# EasyEDA Pro project ProPrj_IoT House_2026-04-28.epro, board PCB1
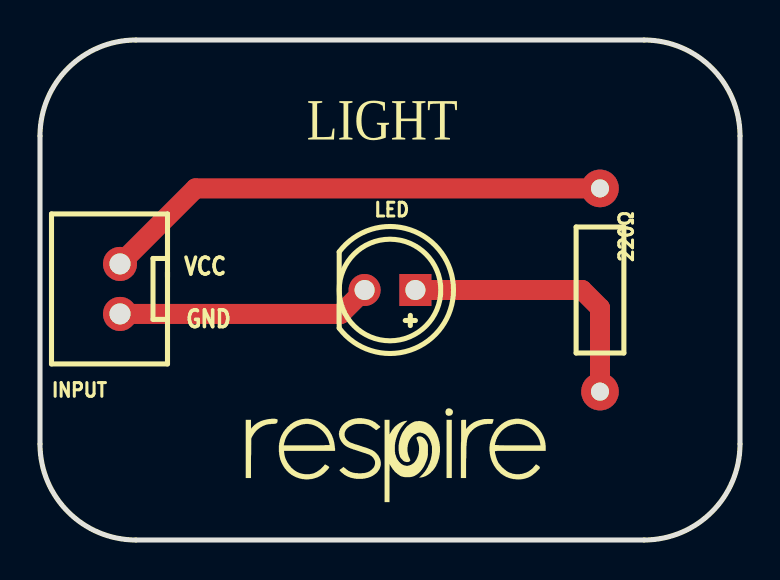
[diagram p5: board, top side]
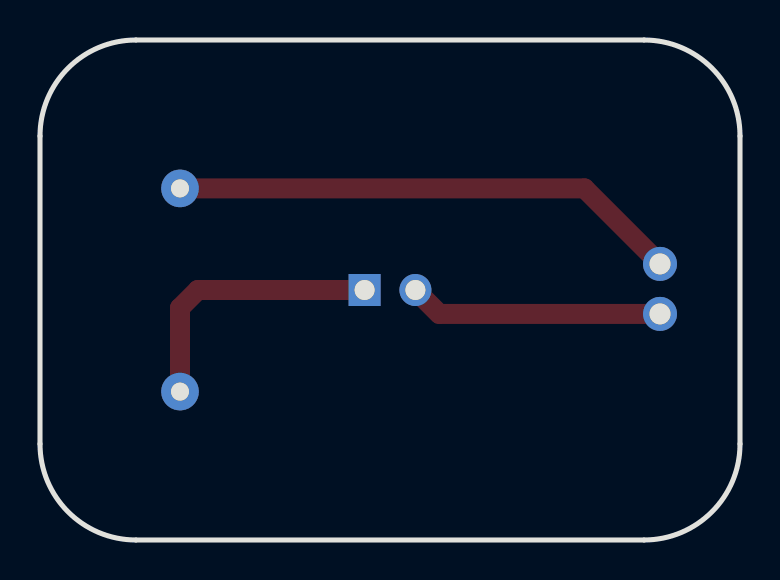
[diagram p6: board, bottom side, seen from below]

Outline 35 x 25 mm; copper layers: Top Layer, Bottom Layer. Coordinates in mm from the lower left corner of the outline.
Outline path: 0,20.2 0,4.8 arc(1.41,1.41) 4.8,0 30.2,0 arc(33.59,1.41) 35,4.8 35,20.2 arc(33.59,23.59) 30.2,25 4.8,25 arc(1.41,23.59) 0,20.2
Stack: Top Layer 0.035mm / Dielectric1 1.51mm FR4 er 4.5 / Bottom Layer 0.035mm

## Design rules (mm)
template: JLCPCB Capability(Two Layers Board)
spacing copperThickness1oz (default): track to track 0.102, other pairs 0.152 to 0.3
spacing copperThickness2oz: track to track 0.203, other pairs 0.152 to 0.3
track width copperThickness1oz (default): min 0.127, default 0.254, max 2.54
track width copperThickness2oz: min 0.203, default 0.254, max 2.54
differential pair differentialPair (default): width min 0.127, default 0.254, max 2.54; gap min 0.152, default 0.152
via viaSize (default): diameter min 0.5, default 0.61, max 10; hole min 0.3, default 0.305, max 6.3

## Placement (name value [footprint] x y rotation side)
220Ω  100  [R_AXIAL-0.4]  28 12.5 270 top
INPUT  XH-2P-2.54  [CONN-TH_2P-P2.50-XH2.54-2P]  4 12.55 270 top
LED  TJ-L5FYTGHRMFCLFLC2R-A5  [LED-TH_BD5.8-P2.54-FD_RED]  17.5 12.5 180 top

## Footprints (pads in the part's own frame, mm; a bottom-side part is the same pattern mirrored in y, then rotated)
CONN-TH_2P-P2.50-XH2.54-2P
  round 1.7 hole 1.05: 1(1.25,0) 2(-1.25,0)
LED-TH_BD5.8-P2.54-FD_RED
  rect 1.6x1.6 hole 1: 1(-1.27,0)
  round 1.6 hole 1: 2(1.27,0)
R_AXIAL-0.4
  round 1.879 hole 0.899: 1(-5.08,0) 2(5.08,0)

## Nets
$1N332: 220Ω.2 LED.1
$1N709: INPUT.1 LED.2
$1N714: 220Ω.1 INPUT.2

## Routing (per net, layer and track width the routed paths; a pad name or vN(x,y) marks a point on that pad's centre or on a via; arc(x,y) is an arc through that point)
$1N332: length 13.8
  Top Layer w1: LED.1 27.1,12.5 28,11.61 220Ω.2
$1N709: length 12.7
  Top Layer w1: LED.2 15.03,11.3 INPUT.1
$1N714: length 25.6
  Top Layer w1: 220Ω.1 7.78,17.58 INPUT.2

## Text on the board
Top Silkscreen Layer: VCC | GND | LIGHT
